# Altium schematic sheet PCB.SchDoc
size A2; SheetNumber: 1; SheetTotal: 1
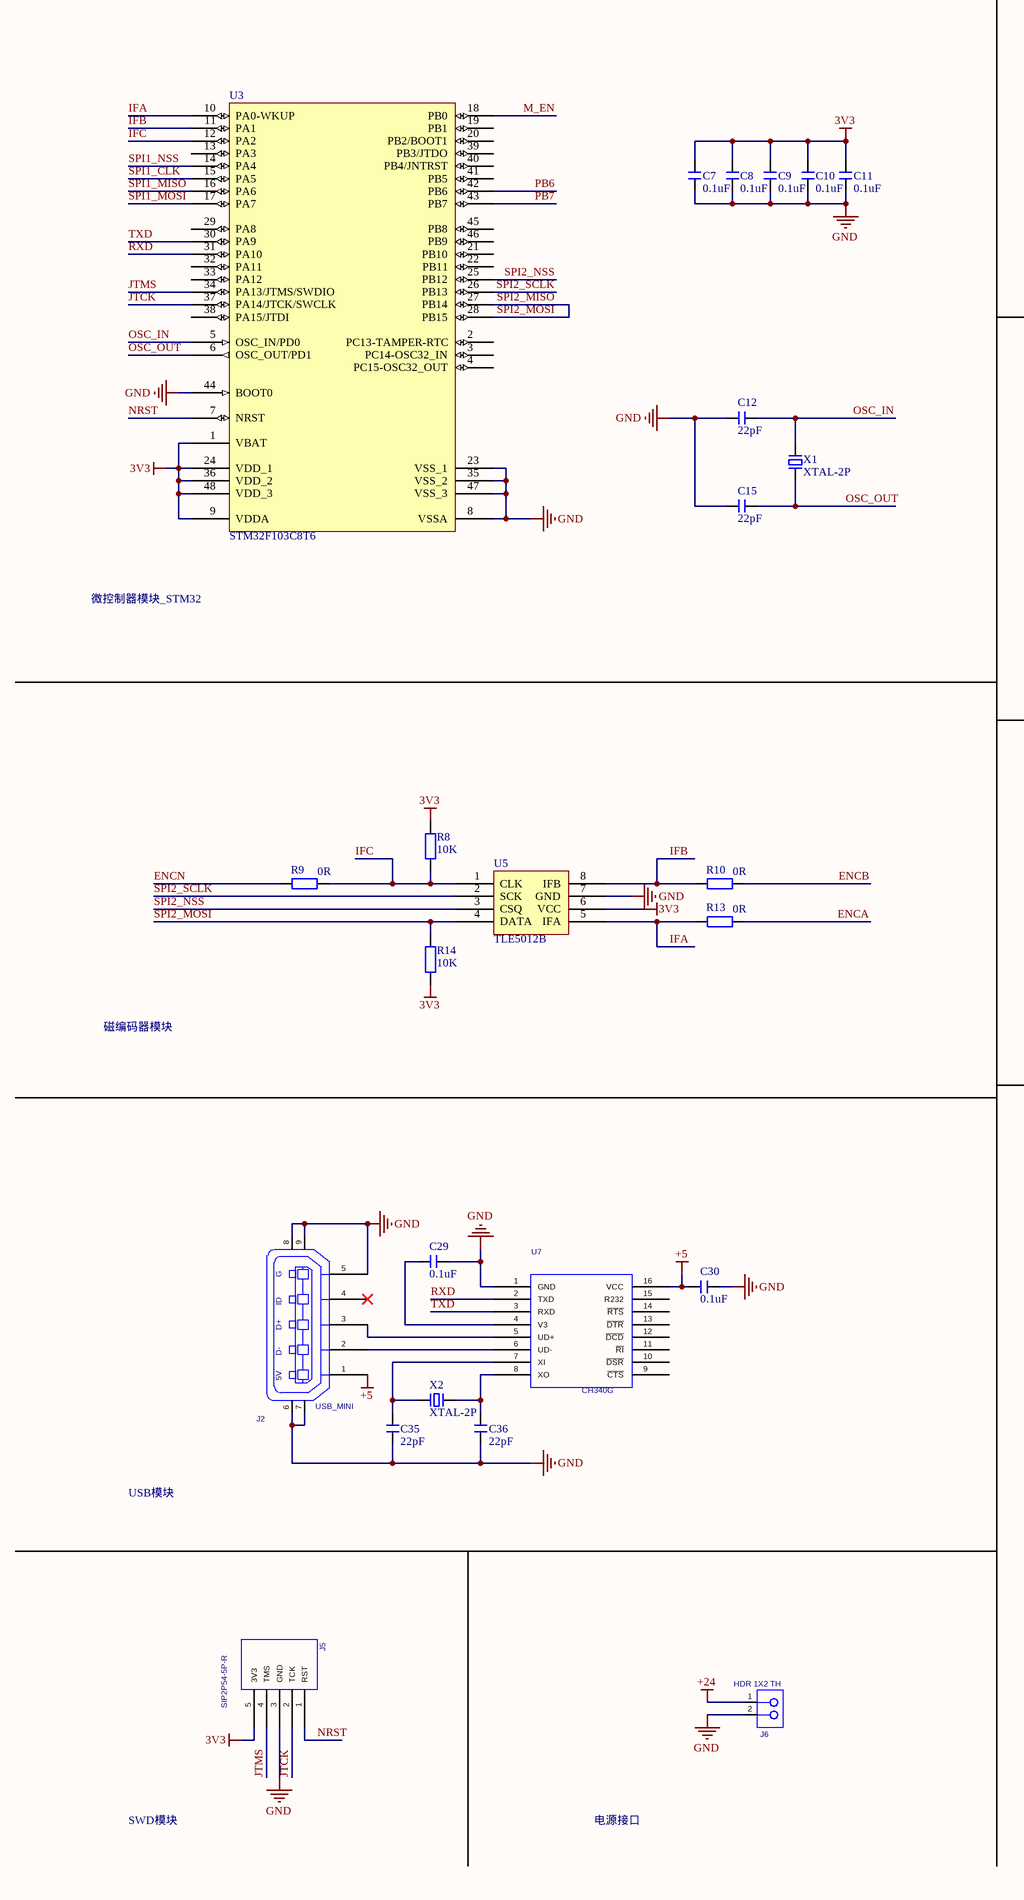
[diagram p0: PCB.SchDoc, left]
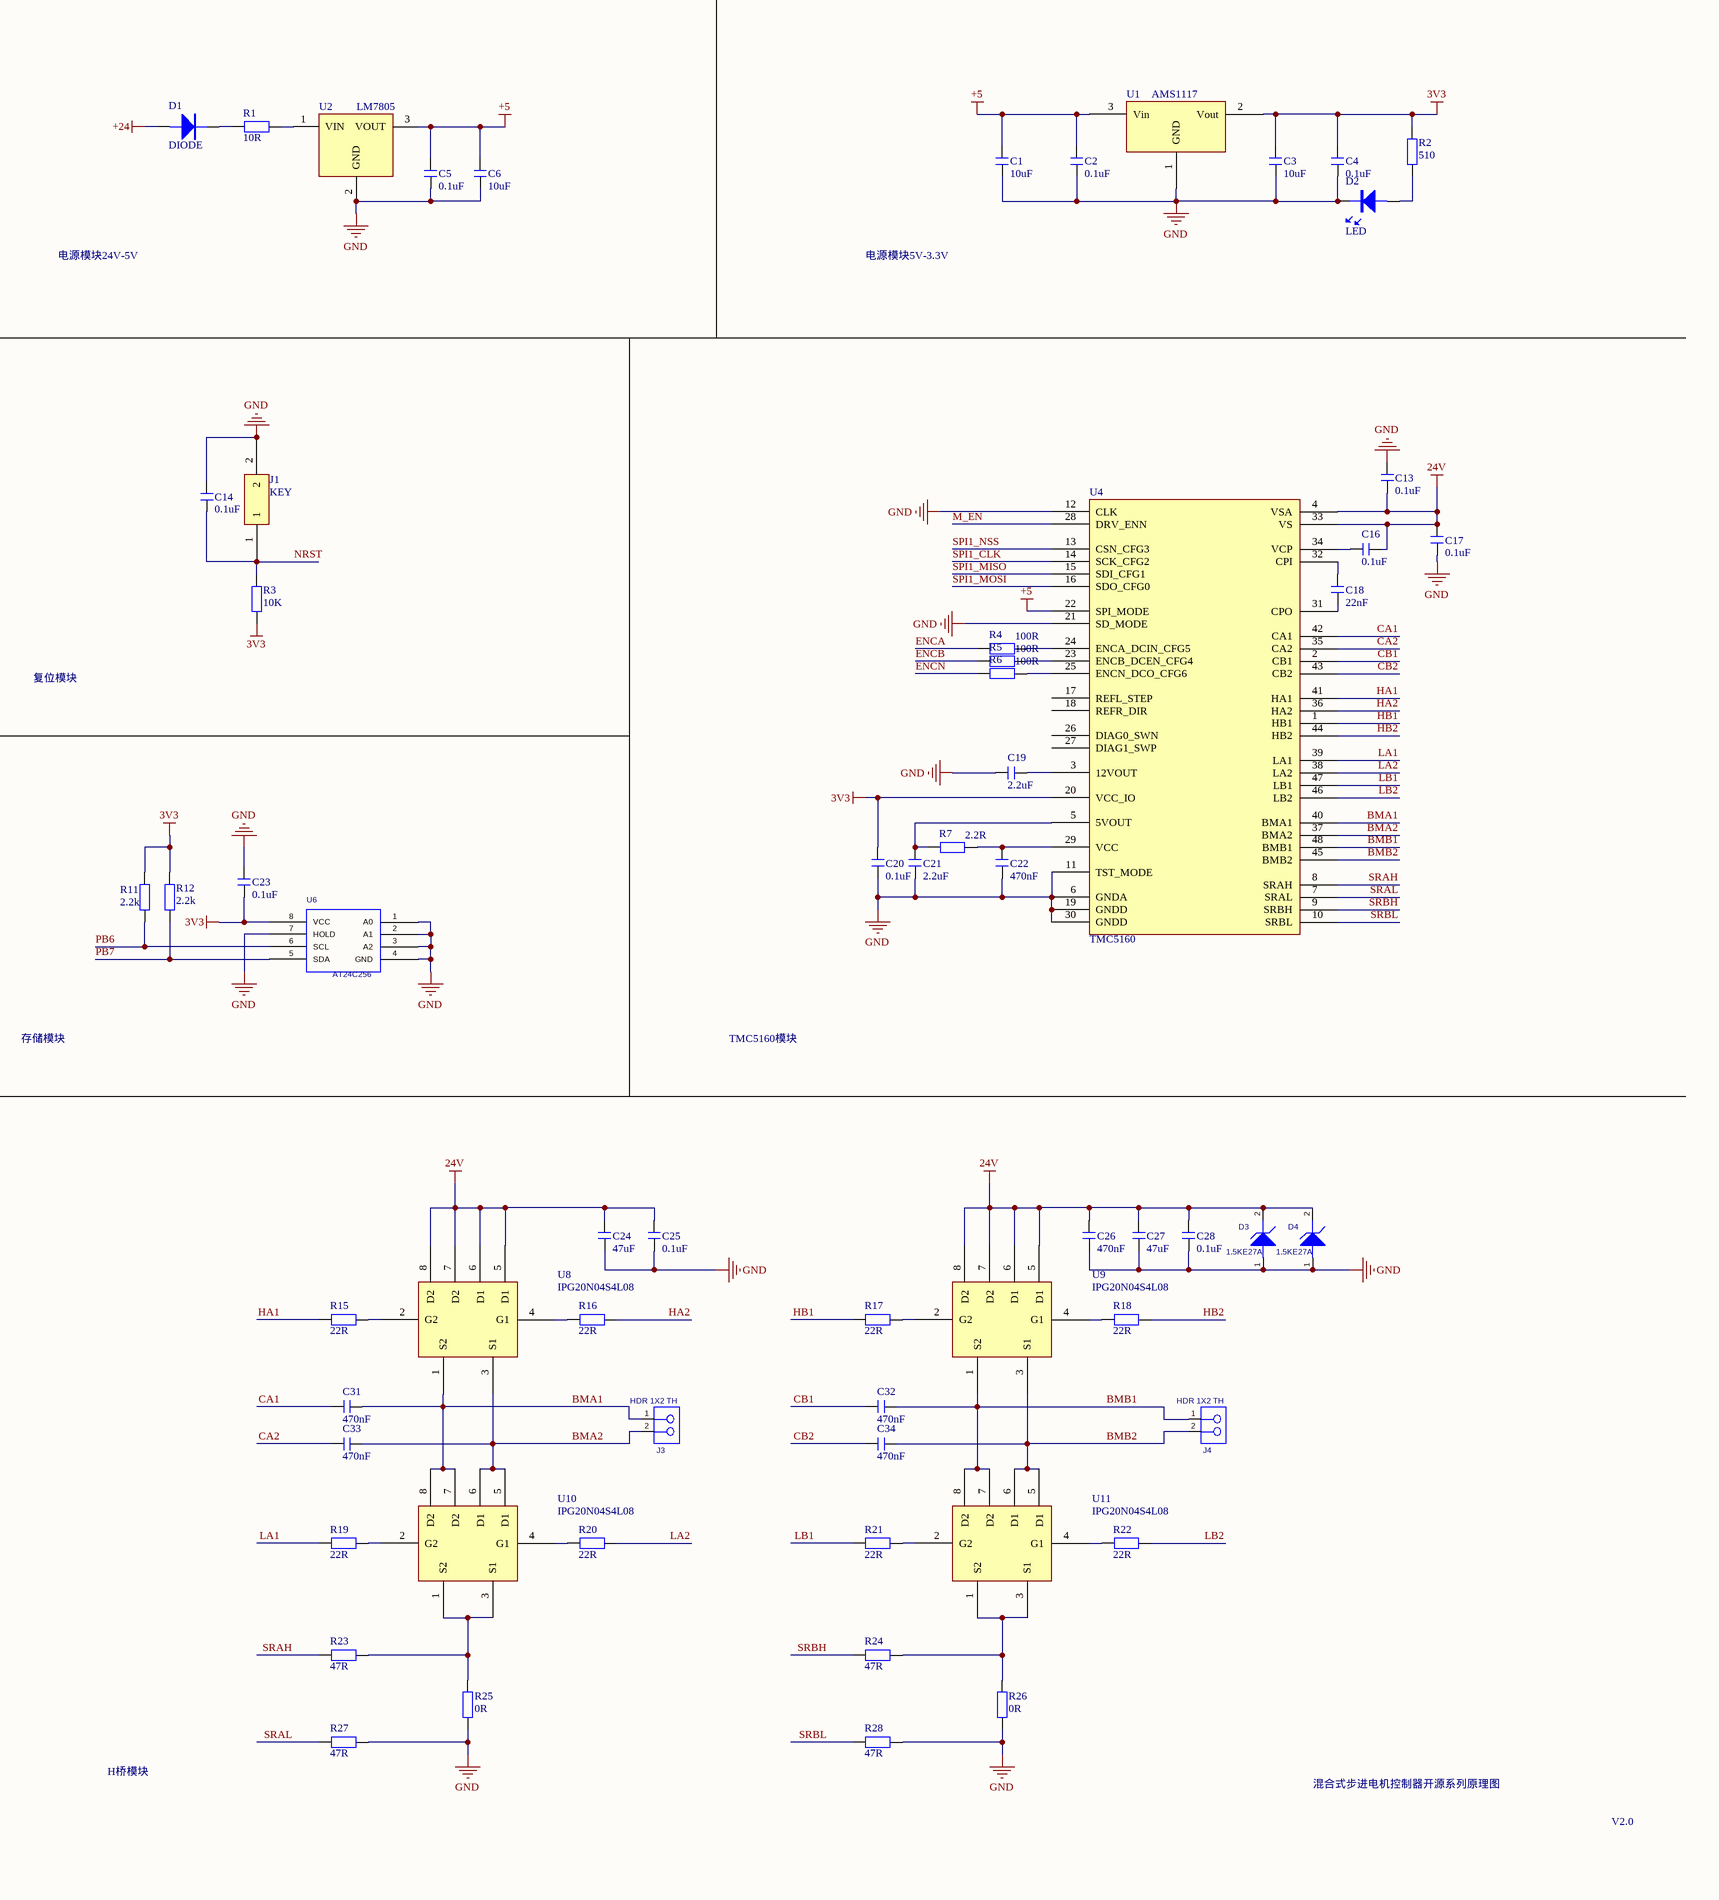
[diagram p1: PCB.SchDoc, right]

## Parts
C1  10uF  [C 0805_L]
C2  0.1uF  [C 0805_L]
C3  10uF  [C 0805_L]
C4  0.1uF  [C 0805_L]
C5  0.1uF  [C 0805_L]
C6  10uF  [C 0805_L]
C7  0.1uF  [C 0805_L]
C8  0.1uF  [C 0805_L]
C9  0.1uF  [C 0805_L]
C10  0.1uF  [C 0805_L]
C11  0.1uF  [C 0805_L]
C12  22pF  [C 0805_L]
C13  0.1uF  [C 0805_L]
C14  0.1uF  [C 0805_L]
C15  22pF  [C 0805_L]
C16  0.1uF  [C 0805_L]
C17  0.1uF  [C 0805_L]
C18  22nF  [C 0805_L]
C19  2.2uF  [C 0805_L]
C20  0.1uF  [C 0805_L]
C21  2.2uF  [C 0805_L]
C22  470nF  [C 0805_L]
C23  0.1uF  [C 0805_L]
C24  47uF  [C 0805_L]
C25  0.1uF  [C 0805_L]
C26  470nF  [C 0805_L]
C27  47uF  [C 0805_L]
C28  0.1uF  [C 0805_L]
C29  0.1uF  [C 0805_L]
C30  0.1uF  [C 0805_L]
C31  470nF  [C 0805_L]
C32  470nF  [C 0805_L]
C33  470nF  [C 0805_L]
C34  470nF  [C 0805_L]
C35  22pF  [C 0805_L]
C36  22pF  [C 0805_L]
D1  DIODE  [SOD-123]
D2  LED  [LED-0805B]
D3  value 1.5KE27A  [D1206]  (hidden comment: ZDIODE_0)
D4  value 1.5KE27A  [D1206]  (hidden comment: ZDIODE_0)
J1  KEY  [KEY3*4*2]
J2  value USB_MINI  [MINI_USB_5S]  (hidden comment: USB_MINI_AB_RECEPTACLE_1)
J3  value HDR 1X2 TH  [CON_2PIN]  (hidden comment: CONN_HDR_2X1)
J4  value HDR 1X2 TH  [CON_2PIN]  (hidden comment: CONN_HDR_2X1)
J5  value SIP2P54-5P-R  [XH2P54-5P_90]  (hidden comment: SIP5_2_1)
J6  value HDR 1X2 TH  [CON_2PIN]  (hidden comment: CONN_HDR_2X1)
R1  10R  [R 0805_L]
R2  510  [R 0805_L]
R3  10K  [R 0805_L]
R4  100R  [R 0805_L]
R5  100R  [R 0805_L]
R6  100R  [R 0805_L]
R7  2.2R  [R 0805_L]
R8  10K  [R 0805_L]
R9  0R  [R 0805_L]
R10  0R  [R 0805_L]
R11  2.2k  [R 0805_L]
R12  2.2k  [R 0805_L]
R13  0R  [R 0805_L]
R14  10K  [R 0805_L]
R15  22R  [R 0805_L]
R16  22R  [R 0805_L]
R17  22R  [R 0805_L]
R18  22R  [R 0805_L]
R19  22R  [R 0805_L]
R20  22R  [R 0805_L]
R21  22R  [R 0805_L]
R22  22R  [R 0805_L]
R23  47R  [R 0805_L]
R24  47R  [R 0805_L]
R25  0R  [R 0805_L]
R26  0R  [R 0805_L]
R27  47R  [R 0805_L]
R28  47R  [R 0805_L]
U1  AMS1117  [SOT223]
U2  LM7805  [TO252]
U3  STM32F103C8T6  [LQFP48 7X7]
U4  TMC5160  [TQFP48 7x7]
U5  TLE5012B  [LC-SO-8_3.9mm]
U6  value AT24C256  [SOP8]  (hidden comment: AT24C02_0)
U7  value CH340G  [SOIC16]  (hidden comment: MAX3232EEAE_1)
U8  IPG20N04S4L08  [PG-TDSON-8_4]
U9  IPG20N04S4L08  [PG-TDSON-8_4]
U10  IPG20N04S4L08  [PG-TDSON-8_4]
U11  IPG20N04S4L08  [PG-TDSON-8_4]
X1  XTAL-2P  [OSC 5032-2P]
X2  XTAL-2P  [OSC 5032-2P]

## Nets
3V3: C3.2 C4.2 C7.2 C8.2 C9.2 C10.2 C11.2 C20.1 C23.1 J5.5(3V3) R2.2 R3.1 R8.2 R11.1 R12.1 R14.1 U1.2(Vout) U3.1(VBAT) U3.9(VDDA) U3.24(VDD_1) U3.36(VDD_2) U3.48(VDD_3) U4.20(VCC_IO) U5.6(VCC) U6.8(VCC)
24V: C13.2 C16.2 C17.1 C24.1 C25.1 C26.1 C27.1 C28.1 D3.2(CATHODE) D4.2(CATHODE) U4.4(VSA) U4.33(VS) U8.5(D1) U8.6(D1) U8.7(D2) U8.8(D2) U9.5(D1) U9.6(D1) U9.7(D2) U9.8(D2)
+5: C1.2 C2.2 C5.2 C6.2 C30.2 J2.1(P1) U1.3(Vin) U2.3(VOUT) U4.22(SPI_MODE) U7.16(VCC)
+24: D1.A J6.1
GND: C1.1 C2.1 C3.1 C4.1 C5.1 C6.1 C7.1 C8.1 C9.1 C10.1 C11.1 C12.2 C13.1 C14.2 C15.2 C17.2 C19.2 C20.2 C21.2 C22.2 C23.2 C24.2 C25.2 C26.2 C27.2 C28.2 C29.2 C30.1 C35.2 C36.2 D2.K D3.1(ANODE) D4.1(ANODE) J1.2 J2.5(P5) J2.6(SHLD1) J2.7(SHLD3) J2.8(SHLD2) J2.9(SHLD4) J5.3(GND) J6.2 R25.2 R26.2 R27.1 R28.1 U1.1(GND) U2.2(GND) U3.8(VSSA) U3.23(VSS_1) U3.35(VSS_2) U3.44(BOOT0) U3.47(VSS_3) U4.6(GNDA) U4.11(TST_MODE) U4.12(CLK) U4.19(GNDD) U4.21(SD_MODE) U4.30(GNDD) U5.7(GND) U6.1(A0) U6.2(A1) U6.3(A2) U6.4(GND) U6.7(HOLD) U7.1(GND)
BMA1: C31.2 J3.1 U4.40(BMA1) U8.1(S2) U10.7(D2) U10.8(D2)
BMA2: C33.2 J3.2 U4.37(BMA2) U8.3(S1) U10.5(D1) U10.6(D1)
BMB1: C32.2 J4.1 U4.48(BMB1) U9.1(S2) U11.7(D2) U11.8(D2)
BMB2: C34.2 J4.2 U4.45(BMB2) U9.3(S1) U11.5(D1) U11.6(D1)
CA1: C31.1 U4.42(CA1)
CA2: C33.1 U4.35(CA2)
CB1: C32.1 U4.2(CB1)
CB2: C34.1 U4.43(CB2)
ENCA: R4.2 R13.1
ENCB: R5.2 R10.1
ENCN: R6.2 R9.2
HA1: R15.2 U4.41(HA1)
HA2: R16.1 U4.36(HA2)
HB1: R17.2 U4.1(HB1)
HB2: R18.1 U4.44(HB2)
IFA: R13.2 U3.10(PA0-WKUP) U5.5(IFA)
IFB: R10.2 U3.11(PA1) U5.8(IFB)
IFC: R8.1 R9.1 U3.12(PA2) U5.1(CLK)
JTCK: J5.2(TCK) U3.37(PA14/JTCK/SWCLK)
JTMS: J5.4(TMS) U3.34(PA13/JTMS/SWDIO)
LA1: R19.2 U4.39(LA1)
LA2: R20.1 U4.38(LA2)
LB1: R21.2 U4.47(LB1)
LB2: R22.1 U4.46(LB2)
M_EN: U3.18(PB0) U4.28(DRV_ENN)
NRST: C14.1 J1.1 J5.1(RST) R3.2 U3.7(NRST)
OSC_IN: C12.1 U3.5(OSC_IN/PD0) X1.2
OSC_OUT: C15.1 U3.6(OSC_OUT/PD1) X1.1
PB6: R11.2 U3.42(PB6) U6.6(SCL)
PB7: R12.2 U3.43(PB7) U6.5(SDA)
RXD: U3.31(PA10) U7.2(TXD)
SPI1_CLK: U3.15(PA5) U4.14(SCK_CFG2)
SPI1_MISO: U3.16(PA6) U4.15(SDI_CFG1)
SPI1_MOSI: U3.17(PA7) U4.16(SDO_CFG0)
SPI1_NSS: U3.14(PA4) U4.13(CSN_CFG3)
SPI2_MISO: R14.2 U3.27(PB14) U3.28(PB15) U5.4(DATA)  [also labelled SPI2_MOSI]
SPI2_NSS: U3.25(PB12) U5.3(CSQ)
SPI2_SCLK: U3.26(PB13) U5.2(SCK)
SRAH: R23.2 U4.8(SRAH)
SRAL: R27.2 U4.7(SRAL)
SRBH: R24.2 U4.9(SRBH)
SRBL: R28.2 U4.10(SRBL)
TXD: U3.30(PA9) U7.3(RXD)
NetC16_1: C16.1 U4.34(VCP)
NetC18_1: C18.1 U4.32(CPI)
NetC18_2: C18.2 U4.31(CPO)
NetC19_1: C19.1 U4.3(12VOUT)
NetC21_1: C21.1 R7.2 U4.5(5VOUT)
NetC22_1: C22.1 R7.1 U4.29(VCC)
NetC29_1: C29.1 U7.4(V3)
NetC35_1: C35.1 U7.7(XI) X2.2
NetC36_1: C36.1 U7.8(XO) X2.1
NetD1_K: D1.K R1.2
NetD2_A: D2.A R2.1
NetJ2_2: J2.2(P2) U7.6(UD-)
NetJ2_3: J2.3(P3) U7.5(UD+)
NetR1_1: R1.1 U2.1(VIN)
NetR4_1: R4.1 U4.24(ENCA_DCIN_CFG5)
NetR5_1: R5.1 U4.23(ENCB_DCEN_CFG4)
NetR6_1: R6.1 U4.25(ENCN_DCO_CFG6)
NetR15_1: R15.1 U8.2(G2)
NetR16_2: R16.2 U8.4(G1)
NetR17_1: R17.1 U9.2(G2)
NetR18_2: R18.2 U9.4(G1)
NetR19_1: R19.1 U10.2(G2)
NetR20_2: R20.2 U10.4(G1)
NetR21_1: R21.1 U11.2(G2)
NetR22_2: R22.2 U11.4(G1)
NetR23_1: R23.1 R25.1 U10.1(S2) U10.3(S1)
NetR24_1: R24.1 R26.1 U11.1(S2) U11.3(S1)

Not connected (* = marked no-connect by the designer): J2 4(P4)*; U3 2(PC13-TAMPER-RTC) 3(PC14-OSC32_IN) 4(PC15-OSC32_OUT) 13(PA3) 19(PB1) 20(PB2/BOOT1) 21(PB10) 22(PB11) 29(PA8) 32(PA11) 33(PA12) 38(PA15/JTDI) 39(PB3/JTDO) 40(PB4/JNTRST) 41(PB5) 45(PB8) 46(PB9); U4 17(REFL_STEP) 18(REFR_DIR) 26(DIAG0_SWN) 27(DIAG1_SWP); U7 9(~{CTS}) 10(~{DSR}) 11(~{RI}) 12(~{DCD}) 13(~{DTR}) 14(~{RTS}) 15(R232)

## Notes on the sheet
- 电源模块24V-5V
- 电源模块5V-3.3V
- 微控制器模块_STM32
- 复位模块
- 磁编码器模块
- 存储模块
- TMC5160模块
- USB模块
- H桥模块
- 混合式步进电机控制器开源系列原理图
- SWD模块
- 电源接口
- V2.0
- (in symbol USB_MINI_AB_RECEPTACLE_1) G; ID; D+; D-; 5V

## Library data of the parts
C1-C36 = C: 无极性贴片电容; 版权归属: 源创客; 材质: X7R; BOM名称: 无极性贴片电容; 学习资源: www.ooocke.com
D1 = DIODE: 普通二极管
D3 D4 = ZDIODE_0_2: DIODE ZNR -- 0.2W 5.1V AEC-Q101 SOD523; AGILE_PN: 480-77217; MFG_NAME01: ON SEMICONDUCTOR; MFG_PN01: MM5Z5V1ST1G; CAD_APPROVED: Yes; Source_Path: H:\NXP_RT1050\SCH\IMXRT1052_MB.DSN; CLASS: IC; PCB DECAL: D1206; ROHS: Yes; HEIGHT: 0.7MM
J2 = USB_MINI_AB_RECEPTACLE_1: CON 5 USB MICRO_AB RA SKT SMT 0.65MM SP 110H AU; CAD_APPROVED: Yes; Temp_Range: -55&#8451; to 105&#8451;; MFG_PN01: 23970101#LCP-58LF; MFG_NAME01: ANYTRONIC CORPORATION LIMITED; AGILE_PN: 211-80104; Source_Path: D:\NXP_RT1050\RT1050_MB_PRO\SCH\IMXRT1052_MB_PRO_0319.DSN; CLASS: IO; PCB DECAL: MINI_USB_5S; HEIGHT: 2.8MM; ROHS: Yes
J3 J4 J6 = CONN_HDR_2X1: HDR 1X2 TH 100MIL SP 339H AU 98L; CAD_APPROVED: YES; MFG_PN01: TSW-102-07-G-S; MFG_NAME01: SAMTEC; AGILE_PN: 210-75439; Source_Path: Q:\ORCADCIS\SYMBOLS\FCL_CONNECTOR.OLB; CLASS: IO; HEIGHT: 8.71 MM; ROHS: Yes; PCB DECAL: CON_2PIN
J5 = SIP5_2_1: Source_Path: F:\NXP\RT1020\SCH\IMXRT1021.DSN; PCB DECAL: XH2P54-5P_90
R1-R28 = R: 贴片电阻; 版权归属: 源创客; BOM名称: 贴片电阻; 学习资源: www.ooocke.com
U1 = AMS1117: 三端稳压芯片
U6 = AT24C02_0: Source_Path: F:\STM32\F407\F407 PRO\SCH\野火_F407霸天虎_原理图_V2.0.DSN; OriginalSymbolOrigin: (-20000,30000); PCB DECAL: SOP8
U7 = MAX3232EEAE_1: Source_Path: H:\NXP_RT1050\SCH\IMXRT1052_MB.DSN; PCB DECAL: SOIC16
X1 X2 = XTAL-2P: 2脚无源脚晶振